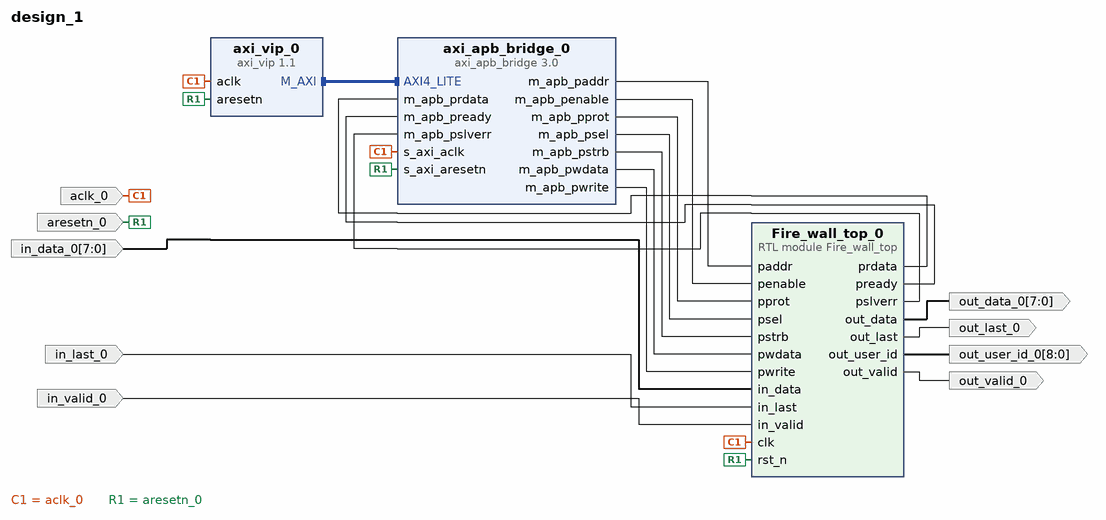
[diagram p0: block diagram of the top level]
# Vivado block design design_1, xczu9eg-ffvb1156-2-e, Vivado 2023.2
create_bd_design design_1

create_bd_port -dir I -type clk aclk_0
create_bd_port -dir I -type rst aresetn_0
create_bd_port -dir I in_valid_0
create_bd_port -dir I in_last_0
create_bd_port -dir I -from 7 -to 0 in_data_0
create_bd_port -dir O out_valid_0
create_bd_port -dir O out_last_0
create_bd_port -dir O -from 7 -to 0 out_data_0
create_bd_port -dir O -from 8 -to 0 out_user_id_0

create_bd_cell -type ip -vlnv xilinx.com:ip:axi_vip:1.1 axi_vip_0
set_property -dict [list \
  CONFIG.ADDR_WIDTH 32 \
  CONFIG.DATA_WIDTH 32 \
  CONFIG.HAS_BRESP 1 \
  CONFIG.HAS_PROT 1 \
  CONFIG.HAS_RRESP 1 \
  CONFIG.HAS_WSTRB 1 \
  CONFIG.INTERFACE_MODE MASTER \
  CONFIG.PROTOCOL AXI4LITE \
  CONFIG.READ_WRITE_MODE READ_WRITE \
] [get_bd_cells axi_vip_0]
create_bd_cell -type ip -vlnv xilinx.com:ip:axi_apb_bridge:3.0 axi_apb_bridge_0
set_property -dict {CONFIG.C_APB_NUM_SLAVES 1 CONFIG.C_M_APB_PROTOCOL apb4} [get_bd_cells axi_apb_bridge_0]
create_bd_cell -type module -reference Fire_wall_top Fire_wall_top_0

# ---- connections ----

connect_bd_intf_net [get_bd_intf_pins axi_vip_0/M_AXI] [get_bd_intf_pins axi_apb_bridge_0/AXI4_LITE]
connect_bd_net [get_bd_pins Fire_wall_top_0/out_data] [get_bd_ports out_data_0]
connect_bd_net [get_bd_pins Fire_wall_top_0/out_last] [get_bd_ports out_last_0]
connect_bd_net [get_bd_pins Fire_wall_top_0/out_user_id] [get_bd_ports out_user_id_0]
connect_bd_net [get_bd_pins Fire_wall_top_0/out_valid] [get_bd_ports out_valid_0]
connect_bd_net [get_bd_pins Fire_wall_top_0/prdata] [get_bd_pins axi_apb_bridge_0/m_apb_prdata]
connect_bd_net [get_bd_pins Fire_wall_top_0/pready] [get_bd_pins axi_apb_bridge_0/m_apb_pready]
connect_bd_net [get_bd_pins Fire_wall_top_0/pslverr] [get_bd_pins axi_apb_bridge_0/m_apb_pslverr]
connect_bd_net -net aclk_0_1 [get_bd_ports aclk_0] \
  [get_bd_pins axi_vip_0/aclk] [get_bd_pins axi_apb_bridge_0/s_axi_aclk] [get_bd_pins Fire_wall_top_0/clk]
connect_bd_net -net aresetn_0_1 [get_bd_ports aresetn_0] \
  [get_bd_pins axi_vip_0/aresetn] [get_bd_pins axi_apb_bridge_0/s_axi_aresetn] [get_bd_pins Fire_wall_top_0/rst_n]
connect_bd_net [get_bd_pins axi_apb_bridge_0/m_apb_paddr] [get_bd_pins Fire_wall_top_0/paddr]
connect_bd_net [get_bd_pins axi_apb_bridge_0/m_apb_penable] [get_bd_pins Fire_wall_top_0/penable]
connect_bd_net [get_bd_pins axi_apb_bridge_0/m_apb_pprot] [get_bd_pins Fire_wall_top_0/pprot]
connect_bd_net [get_bd_pins axi_apb_bridge_0/m_apb_psel] [get_bd_pins Fire_wall_top_0/psel]
connect_bd_net [get_bd_pins axi_apb_bridge_0/m_apb_pstrb] [get_bd_pins Fire_wall_top_0/pstrb]
connect_bd_net [get_bd_pins axi_apb_bridge_0/m_apb_pwdata] [get_bd_pins Fire_wall_top_0/pwdata]
connect_bd_net [get_bd_pins axi_apb_bridge_0/m_apb_pwrite] [get_bd_pins Fire_wall_top_0/pwrite]
connect_bd_net -net in_data_0_1 [get_bd_ports in_data_0] [get_bd_pins Fire_wall_top_0/in_data]
connect_bd_net -net in_last_0_1 [get_bd_ports in_last_0] [get_bd_pins Fire_wall_top_0/in_last]
connect_bd_net -net in_valid_0_1 [get_bd_ports in_valid_0] [get_bd_pins Fire_wall_top_0/in_valid]

validate_bd_design
save_bd_design
